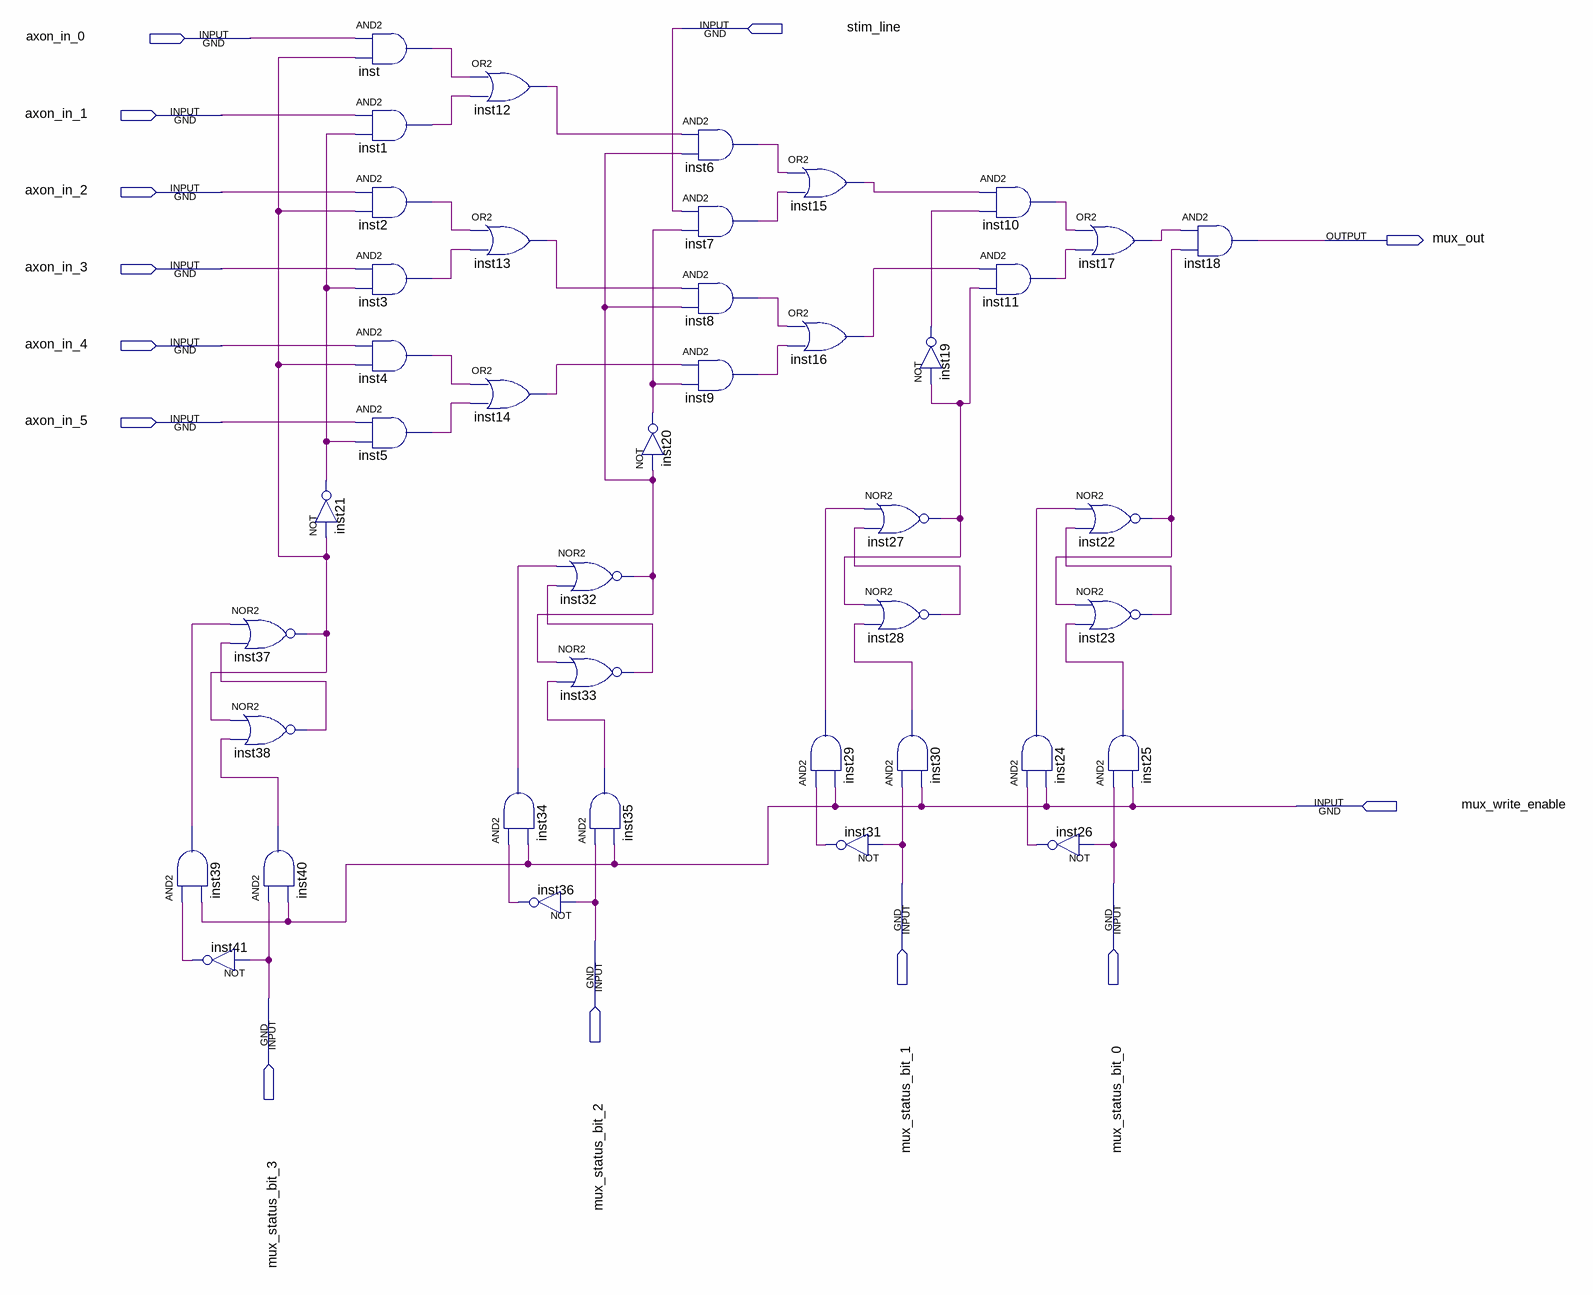
[diagram p0: schematic sheet]
// Quartus schematic synapse_mux.bdf as structural Verilog: 42 symbols, 13 pins
module synapse_mux (
  input  stim_line,
  input  axon_in_0,
  input  axon_in_1,
  input  axon_in_2,
  input  axon_in_3,
  input  axon_in_4,
  input  axon_in_5,
  input  mux_write_enable,
  input  mux_status_bit_1,
  input  mux_status_bit_0,
  input  mux_status_bit_2,
  input  mux_status_bit_3,
  output mux_out
);

  wire inst1_out, inst2_out, inst3_out, inst4_out, inst5_out, inst6_out, inst7_out, inst8_out, inst9_out,
       inst10_out, inst11_out, inst12_out, inst13_out, inst14_out, inst15_out, inst16_out, inst17_out,
       inst19_out, inst20_out, inst21_out, inst22_out, inst23_out, inst24_out, inst25_out, inst26_out,
       inst27_out, inst28_out, inst29_out, inst30_out, inst31_out, inst32_out, inst33_out, inst34_out,
       inst35_out, inst36_out, inst37_out, inst38_out, inst39_out, inst40_out, inst41_out, inst_out;

  and inst39 (inst39_out, inst41_out, mux_write_enable);
  nor inst37 (inst37_out, inst39_out, inst38_out);
  nor inst38 (inst38_out, inst37_out, inst40_out);
  not inst41 (inst41_out, mux_status_bit_3);
  not inst21 (inst21_out, inst37_out);
  and inst40 (inst40_out, mux_status_bit_3, mux_write_enable);
  and inst (inst_out, axon_in_0, inst37_out);
  and inst1 (inst1_out, axon_in_1, inst21_out);
  and inst2 (inst2_out, axon_in_2, inst37_out);
  and inst3 (inst3_out, axon_in_3, inst21_out);
  and inst4 (inst4_out, axon_in_4, inst37_out);
  and inst5 (inst5_out, axon_in_5, inst21_out);
  or inst12 (inst12_out, inst_out, inst1_out);
  or inst13 (inst13_out, inst2_out, inst3_out);
  or inst14 (inst14_out, inst4_out, inst5_out);
  and inst34 (inst34_out, inst36_out, mux_write_enable);
  not inst36 (inst36_out, mux_status_bit_2);
  nor inst32 (inst32_out, inst34_out, inst33_out);
  nor inst33 (inst33_out, inst32_out, inst35_out);
  and inst35 (inst35_out, mux_status_bit_2, mux_write_enable);
  and inst6 (inst6_out, inst12_out, inst32_out);
  and inst7 (inst7_out, stim_line, inst20_out);
  and inst8 (inst8_out, inst13_out, inst32_out);
  and inst9 (inst9_out, inst14_out, inst20_out);
  not inst20 (inst20_out, inst32_out);
  or inst15 (inst15_out, inst6_out, inst7_out);
  or inst16 (inst16_out, inst8_out, inst9_out);
  and inst29 (inst29_out, inst31_out, mux_write_enable);
  not inst31 (inst31_out, mux_status_bit_1);
  not inst19 (inst19_out, inst27_out);
  nor inst27 (inst27_out, inst29_out, inst28_out);
  nor inst28 (inst28_out, inst27_out, inst30_out);
  and inst30 (inst30_out, mux_status_bit_1, mux_write_enable);
  and inst10 (inst10_out, inst15_out, inst19_out);
  and inst11 (inst11_out, inst16_out, inst27_out);
  and inst24 (inst24_out, inst26_out, mux_write_enable);
  or inst17 (inst17_out, inst10_out, inst11_out);
  nor inst22 (inst22_out, inst24_out, inst23_out);
  nor inst23 (inst23_out, inst22_out, inst25_out);
  not inst26 (inst26_out, mux_status_bit_0);
  and inst25 (inst25_out, mux_status_bit_0, mux_write_enable);
  and inst18 (mux_out, inst17_out, inst22_out);
endmodule
